# EAGLE schematic schematic (EAGLE 8.2.1)
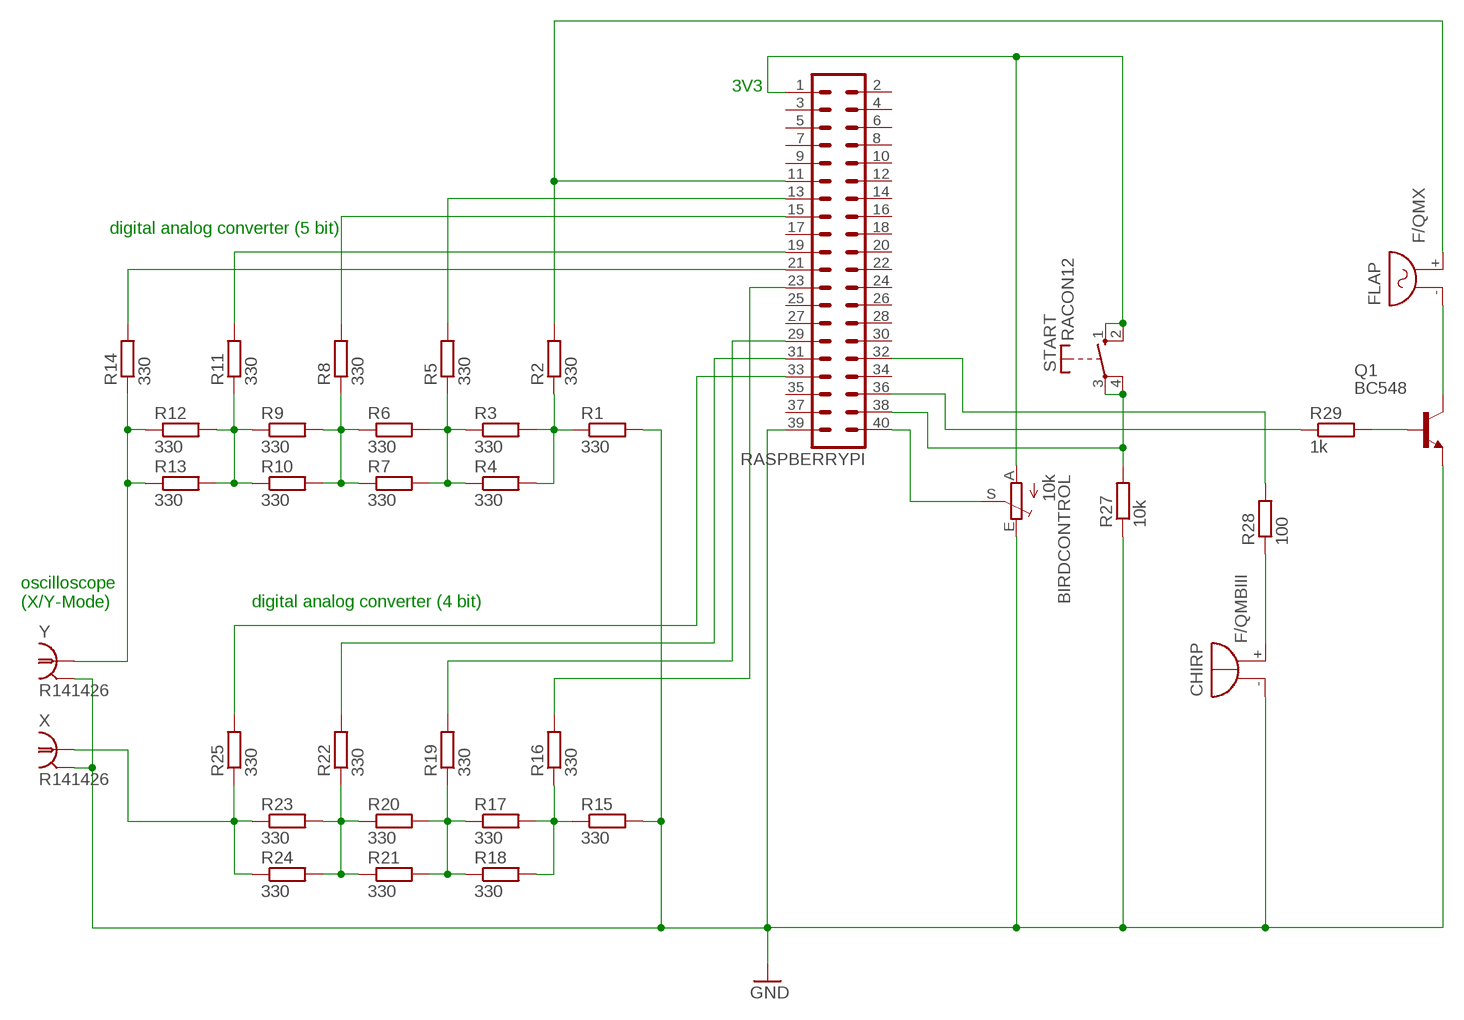
[diagram p0: schematic, sheet 1]

## Parts
BIRDCONTROL  10k  TRIM_EU-CIP20C-6MM  [CIP20C-6MM]
CHIRP  F/QMBIII  [F/QMBIII]
FLAP  F/QMX  [F/QMX]
Q1  BC548  [TO92-EBC]
R1  330  R-EU_0204/7  [0204/7]
R2  330  R-EU_0204/7  [0204/7]
R3  330  R-EU_0204/7  [0204/7]
R4  330  R-EU_0204/7  [0204/7]
R5  330  R-EU_0204/7  [0204/7]
R6  330  R-EU_0204/7  [0204/7]
R7  330  R-EU_0204/7  [0204/7]
R8  330  R-EU_0204/7  [0204/7]
R9  330  R-EU_0204/7  [0204/7]
R10  330  R-EU_0204/7  [0204/7]
R11  330  R-EU_0204/7  [0204/7]
R12  330  R-EU_0204/7  [0204/7]
R13  330  R-EU_0204/7  [0204/7]
R14  330  R-EU_0204/7  [0204/7]
R15  330  R-EU_0204/7  [0204/7]
R16  330  R-EU_0204/7  [0204/7]
R17  330  R-EU_0204/7  [0204/7]
R18  330  R-EU_0204/7  [0204/7]
R19  330  R-EU_0204/7  [0204/7]
R20  330  R-EU_0204/7  [0204/7]
R21  330  R-EU_0204/7  [0204/7]
R22  330  R-EU_0204/7  [0204/7]
R23  330  R-EU_0204/7  [0204/7]
R24  330  R-EU_0204/7  [0204/7]
R25  330  R-EU_0204/7  [0204/7]
R27  10k  R-EU_0204/7  [0204/7]
R28  100  R-EU_0204/7  [0204/7]
R29  1k  R-EU_0204/7  [0204/7]
RASPBERRYPI  MA20-2  [MA20-2]
START  RACON12  [RACON12]
X  R141426  [R141426]
Y  R141426  [R141426]

## Nets
GND: BIRDCONTROL.E CHIRP.-(+) Q1.E R1.2 R15.2 R27.1 RASPBERRYPI.39 X.2 X.3 X.4 X.5 Y.2 Y.3 Y.4 Y.5
N$1: R1.1 R2.1 R3.2 R4.2
N$2: R3.1 R4.1 R5.1 R6.2 R7.2
N$3: R6.1 R7.1 R8.1 R9.2 R10.2
N$4: FLAP.+ R2.2 RASPBERRYPI.11
N$5: R9.1 R10.1 R11.1 R12.2 R13.2
N$6: R12.1 R13.1 R14.1 Y.1
N$7: R15.1 R16.1 R17.2 R18.2
N$8: R5.2 RASPBERRYPI.13
N$9: R8.2 RASPBERRYPI.15
N$10: R11.2 RASPBERRYPI.19
N$11: R14.2 RASPBERRYPI.21
N$12: R17.1 R18.1 R19.1 R20.2 R21.2
N$13: R20.1 R21.1 R22.1 R23.2 R24.2
N$14: R23.1 R24.1 R25.1 X.1
N$15: R16.2 RASPBERRYPI.23
N$16: R19.2 RASPBERRYPI.29
N$17: R27.2 RASPBERRYPI.38 START.3(P) START.4(P)
N$18: R22.2 RASPBERRYPI.31
N$19: R25.2 RASPBERRYPI.33
N$20: BIRDCONTROL.A RASPBERRYPI.1 START.1(S) START.2(S)
N$21: Q1.B R29.2
N$22: CHIRP.+(-) R28.1
N$23: BIRDCONTROL.S RASPBERRYPI.40
N$24: R29.1 RASPBERRYPI.36
N$25: R28.2 RASPBERRYPI.32
N$27: FLAP.-
Unconnected: Q1.C RASPBERRYPI.2 RASPBERRYPI.3 RASPBERRYPI.4 RASPBERRYPI.5 RASPBERRYPI.6 RASPBERRYPI.7 RASPBERRYPI.8 RASPBERRYPI.9 RASPBERRYPI.10 RASPBERRYPI.12 RASPBERRYPI.14 RASPBERRYPI.16 RASPBERRYPI.17 RASPBERRYPI.18 RASPBERRYPI.20 RASPBERRYPI.22 RASPBERRYPI.24 RASPBERRYPI.25 RASPBERRYPI.26 RASPBERRYPI.27 RASPBERRYPI.28 RASPBERRYPI.30 RASPBERRYPI.34 RASPBERRYPI.35 RASPBERRYPI.37

## Notes on the sheet
- 3V3
- digital analog converter (5 bit)
- oscilloscope
  (X/Y-Mode)
- digital analog converter (4 bit)

## Library data of the parts
BIRDCONTROL = pot:TRIM_EU-: POTENTIOMETER
CHIRP = buzzer:F/QMBIII: BUZZER Source: Buerklin; OC_FARNELL: unknown; OC_NEWARK: unknown
FLAP = buzzer:F/QMX: BUZZER Source: Buerklin; OC_FARNELL: unknown; OC_NEWARK: unknown
Q1 = transistor-npn:BC548*: NPN Transistor
R1-R25 R27-R29 = rcl:R-EU_: RESISTOR, European symbol
RASPBERRYPI = con-lstb:MA20-2: PIN HEADER; OC_FARNELL: unknown; OC_NEWARK: unknown
START = switch-misc:RACON12: ITT SWITCH
X Y = con-coax:R141426: BNC COAX CONNECTOR Radiall 50/75 Ohm Spoerle; MF: FARNELL; MPN: R141426161; OC_FARNELL: 4195115; OC_NEWARK: 14J7919